# Altium schematic sheet 原理图.SchDoc
size A4; PageSetup: Record=PageOptions|CenterHorizontal=True|CenterVertical=True|PrintScale=0.97|XCorrection=1.00|YCorrection=1.00|PrintKind=0|BorderSize=5000000|LeftOffset=0|BottomOffset=0|Orientation=2|PaperLength=1000|PaperWidth=1000|Scale=100|PaperSource=7|PrintQuality=-3|MediaType=1|DitherType=10|PaperKind=A4|PrintScaleMode=1
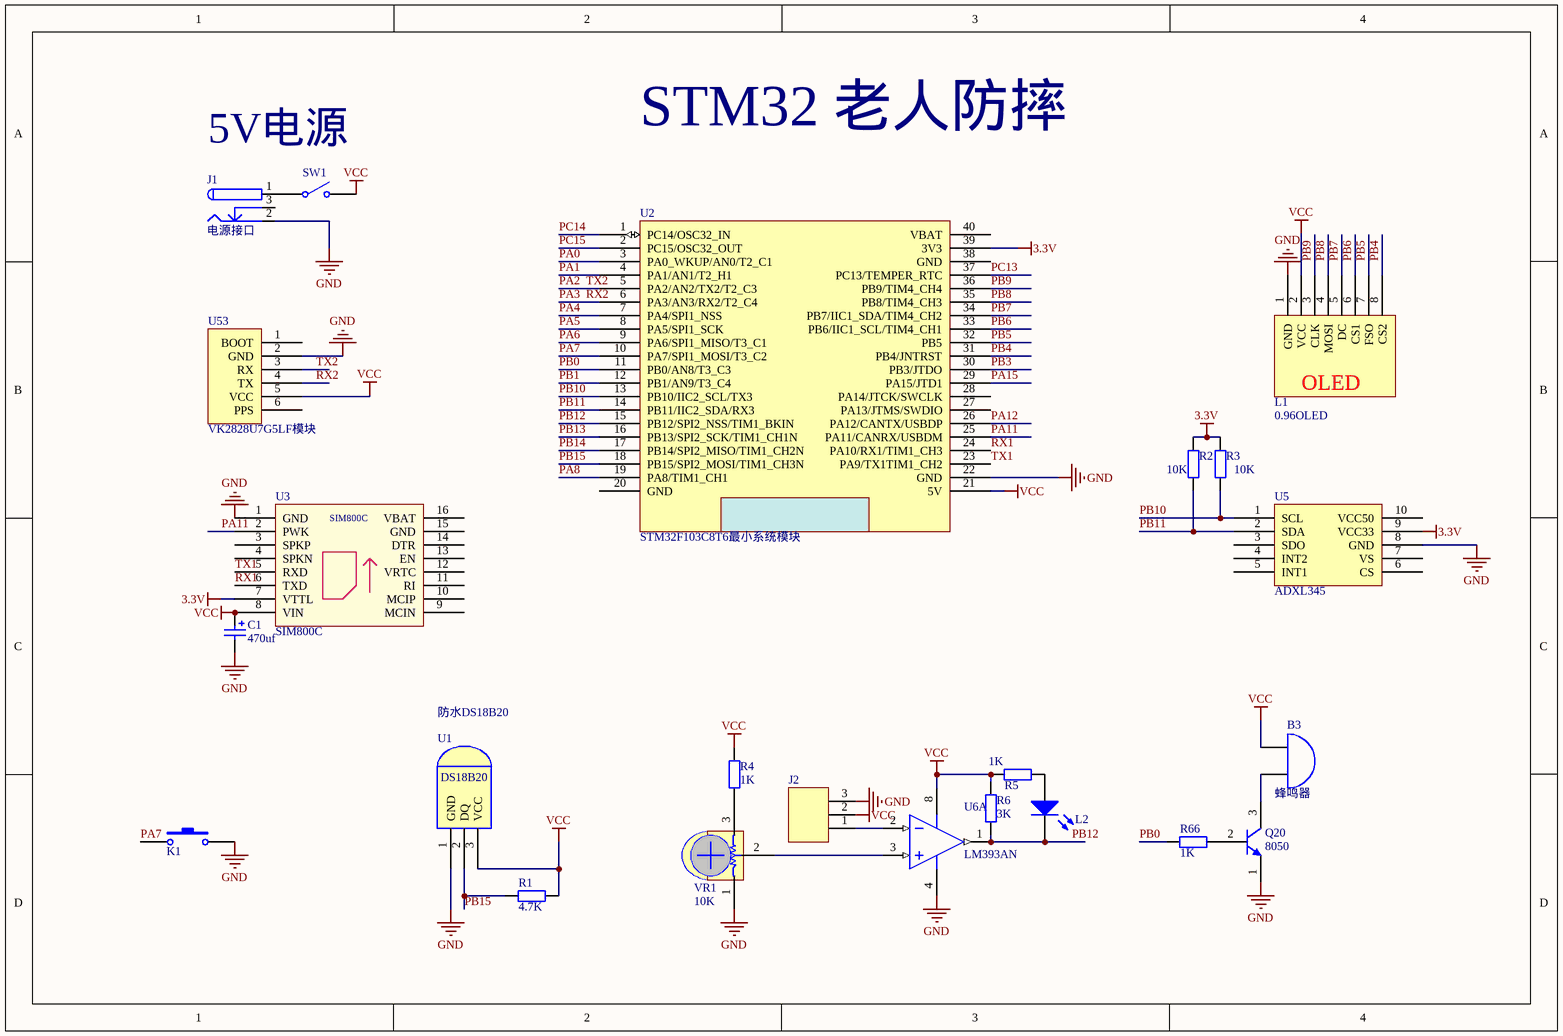
[diagram p0: 原理图.SchDoc]

## Parts
B3  蜂鸣器  [Buzzy-Small]
C1  470uf  [CD5.08cm-10*16-M]
J1  电源接口  [DC-JACK]
J2  (no value)  [3ZHEN-100mil]
K1  SW-AJ  [sw-6-6]  (value not drawn)
L1  0.96OLED  [OLED_0.96]
L2  LED  [LED-3]  (value not drawn)
Q20  8050  [TO-92-2N3906]
R1  4.7K  [AXIAL-0.3]
R2  10K  [AXIAL-0.3]
R3  10K  [AXIAL-0.3]
R4  1k  [AXIAL-0.3]
R5  1K  [AXIAL-0.3]
R6  3k  [AXIAL-0.3]
R66  1K  [AXIAL-0.3]
SW1  自锁开关  [SW1]  (value not drawn)
U1  防水DS18B20  [DS18b20]
U2  STM32F103C8T6最小系统模块  [STM32F103C8T6最下系统模块]
U3  SIM800C  [SIM800C]
U5  ADXL345  [ADXL345]
U6  LM393AN  [DIP8]  (part A of 2)
U53  VK2828U7G5LF模块  [HDR1X6H]
VR1  10K  [W2]

## Nets
3.3V: R2.2 R3.2 U2.39(3V3) U3.7(VTTL) U5.9(VCC33)
GND: C1.2 J1.2 J2.3 K1.2 L1.1(GND) Q20.1(E) U1.1(GND) U2.22(GND) U3.1(GND) U5.8(GND) U6.4(GND) U53.2(GND) VR1.1
VCC: B3.1(A) C1.1 J2.2 L1.2(VCC) R1.2 R4.1 R5.1 R6.1 SW1.2(NO) U1.3(VCC) U2.21(5V) U3.8(VIN) U6.8(V+) U53.5(VCC)
PA0: U2.3(PA0_WKUP/AN0/T2_C1)
PA1: U2.4(PA1/AN1/T2_H1)
PA2: U2.5(PA2/AN2/TX2/T2_C3) U53.3(RX)  [also labelled TX2]
PA3: U2.6(PA3/AN3/RX2/T2_C4) U53.4(TX)  [also labelled RX2]
PA4: U2.7(PA4/SPI1_NSS)
PA5: U2.8(PA5/SPI1_SCK)
PA6: U2.9(PA6/SPI1_MISO/T3_C1)
PA7: K1.1 U2.10(PA7/SPI1_MOSI/T3_C2)
PA8: U2.19(PA8/TIM1_CH1)
PA11: U2.25(PA11/CANRX/USBDM) U3.2(PWK)
PA12: U2.26(PA12/CANTX/USBDP)
PA15: U2.29(PA15/JTD1)
PB0: R66.1 U2.11(PB0/AN8/T3_C3)
PB1: U2.12(PB1/AN9/T3_C4)
PB3: U2.30(PB3/JTDO)
PB4: L1.8(CS2) U2.31(PB4/JNTRST)
PB5: L1.7(FSO) U2.32(PB5)
PB6: L1.6(CS1) U2.33(PB6/IIC1_SCL/TIM4_CH1)
PB7: L1.5(DC) U2.34(PB7/IIC1_SDA/TIM4_CH2)
PB8: L1.4(MOSI) U2.35(PB8/TIM4_CH3)
PB9: L1.3(CLK) U2.36(PB9/TIM4_CH4)
PB10: R3.1 U2.13(PB10/IIC2_SCL/TX3) U5.1(SCL)
PB11: R2.1 U2.14(PB11/IIC2_SDA/RX3) U5.2(SDA)
PB12: L2.2(K) R6.2 U2.15(PB12/SPI2_NSS/TIM1_BKIN) U6.1(OUT)
PB13: U2.16(PB13/SPI2_SCK/TIM1_CH1N)
PB14: U2.17(PB14/SPI2_MISO/TIM1_CH2N)
PB15: R1.1 U1.2(DQ) U2.18(PB15/SPI2_MOSI/TIM1_CH3N)
PC13: U2.37(PC13/TEMPER_RTC)
PC14: U2.1(PC14/OSC32_IN)
PC15: U2.2(PC15/OSC32_OUT)
RX1: U2.24(PA10/RX1/TIM1_CH3) U3.6(TXD)
TX1: U2.23(PA9/TX1TIM1_CH2) U3.5(RXD)
NetB3_2: B3.2(B) Q20.3(C)
NetJ1_1: J1.1 SW1.1(COMMON)
NetJ2_1: J2.1 U6.2(IN-)
NetL2_1: L2.1(A) R5.2
NetQ20_2: Q20.2(B) R66.2
NetR4_2: R4.2 VR1.3
NetU6_3: U6.3(IN+) VR1.2

Not connected (* = marked no-connect by the designer): J1 3; U2 20(GND) 27(PA13/JTMS/SWDIO) 28(PA14/JTCK/SWCLK) 38(GND) 40(VBAT); U3 3(SPKP) 4(SPKN) 9(MCIN) 10(MCIP) 11(RI) 12(VRTC) 13(EN) 14(DTR) 15(GND) 16(VBAT); U5 3(SDO) 4(INT2) 5(INT1) 6(CS) 7(VS) 10(VCC50); U53 1(BOOT) 6(PPS)

## Notes on the sheet
- 5V电源
- STM32 老人防摔
- (in symbol OLED_0.96) OLED
- (in symbol RES0.2) 3K; 1K

## Library data of the parts
B3 = Bell: Electrical Bell; Published: 24-Mar-1999; LatestRevisionDate: 17-Jul-2002; LatestRevisionNote: Re-released for DXP Platform.; PackageReference: PIN2; Publisher: Altium Limited; Value: 蜂鸣器
C1 = Cap Pol
J1 = PWR2.5: Low Voltage Power Supply Connector; Published: 17-Dec-2003; DatasheetDocument: 09-May-2002; Publisher: Altium Limited; ComponentLink1Description: Manufacturer Link; ComponentLink1URL: http://domino.kycon.com/internet/Products.html
J2 = H3
L1 = OLED_0.96
Q20 = 8050: Value: 8050三极管
R1 = RES2: Resistor; Value: 4.7K电阻
R2-R4 R6 = RES0.2
R5 = RES0.4
R66 = RES2: Resistor; Value: 1K电阻
SW1 = SW-SPST
U1 = DS18B20: Value: DS18B20温度传感器
U2 = STM32F103C8T6最下系统模块
U6 = LM393AN: Dual Comparator; Published: 17-Jul-2002; LatestRevisionDate: 06-Jun-2005; LatestRevisionNote: Stylized 3D Model Added.; DatasheetVersion: 1988; PackageReference: 626-05; Publisher: Altium Limited; PackageDescription: DIP; 8 Leads; Row Spacing 7.62 mm; Pitch 2.54 mm; ComponentLink1Description: Manufacturer Link; ComponentLink1URL: http://www.onsemi.com/site/products/taxonomy/0,4438,133,00.html
U53 = gps: Value: VK2828U7G5LFGPS模块+6P排针+6P排线
VR1 = 电位器-蓝白: Value: 103蓝白滑动变阻器